# EAGLE design signal-tower (EAGLE 7.3.0)
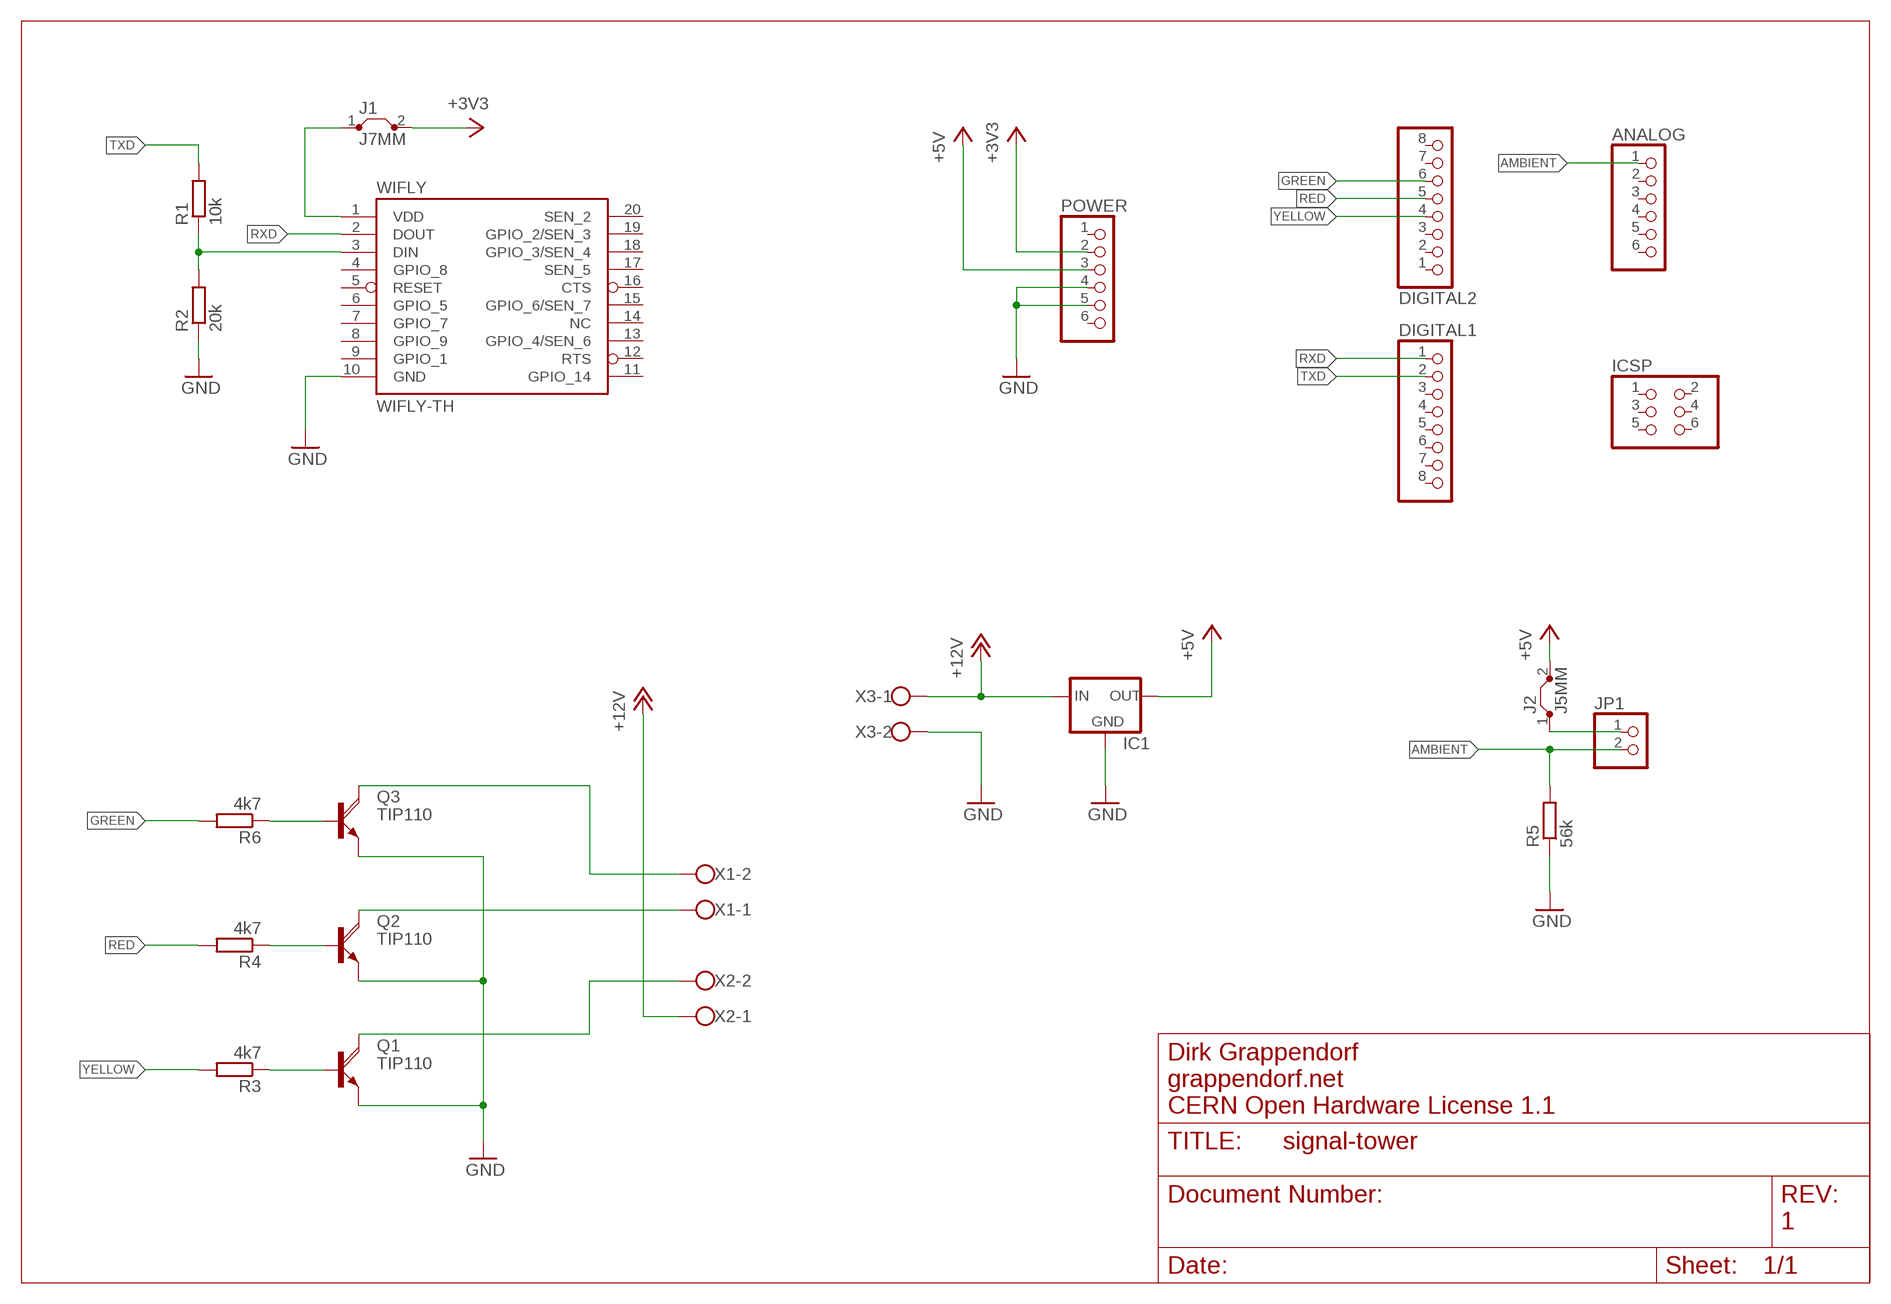
[diagram p0: schematic, sheet 1]

## Parts
ANALOG  PINHD-1X6  [1X06]
DIGITAL1  PINHD-1X8TH  [1X08-TH]
DIGITAL2  PINHD-1X8_2.54  [1X08]
IC1  78XXS  [78XXS]
ICSP  PINHD-2X3  [2X03]
J1  J7MM  [07]
J2  J5MM  [05]
JP1  PINHD-1X2  [1X02]
POWER  PINHD-1X6_2.54  [1X06]
Q1  TIP110  [TO220BV]
Q2  TIP110  [TO220BV]
Q3  TIP110  [TO220BV]
R1  10k  R-EU_0204/7  [0204/7]
R2  20k  R-EU_0204/7  [0204/7]
R3  4k7  R-EU_0204/7  [0204/7]
R4  4k7  R-EU_0204/7  [0204/7]
R5  56k  R-EU_0204/7  [0204/7]
R6  4k7  R-EU_0204/7  [0204/7]
WIFLY  WIFLY-TH  [WIFLY-TH]
X1  W237-102  [W237-102]
X2  W237-102  [W237-102]
X3  W237-102  [W237-102]

## Nets
+3V3: J1.2 POWER.2
+5V: IC1.OUT J2.2 POWER.3
+12V: IC1.IN X2.1 X3.1
AMBIENT: ANALOG.1 JP1.2 R5.2
GND: IC1.GND POWER.4 POWER.5 Q1.S(E) Q2.S(E) Q3.S(E) R2.1 R5.1 WIFLY.10(GND) X3.2
GREEN: DIGITAL2.6 R6.2
N$1: R1.1 R2.2 WIFLY.3(DIN)
N$2: Q3.D(C) X1.2
N$3: J1.1 WIFLY.1(VDD)
N$4: Q1.G(B) R3.1
N$5: Q2.G(B) R4.1
N$6: Q3.G(B) R6.1
N$7: Q2.D(C) X1.1
N$8: Q1.D(C) X2.2
N$10: J2.1 JP1.1
RED: DIGITAL2.5 R4.2
RXD: DIGITAL1.1 WIFLY.2(DOUT)
TXD: DIGITAL1.2 R1.2
YELLOW: DIGITAL2.4 R3.2
Unconnected: ANALOG.2 ANALOG.3 ANALOG.4 ANALOG.5 ANALOG.6 DIGITAL1.3 DIGITAL1.4 DIGITAL1.5 DIGITAL1.6 DIGITAL1.7 DIGITAL1.8 DIGITAL2.1 DIGITAL2.2 DIGITAL2.3 DIGITAL2.7 DIGITAL2.8 ICSP.1 ICSP.2 ICSP.3 ICSP.4 ICSP.5 ICSP.6 POWER.1 POWER.6 WIFLY.4(GPIO_8) WIFLY.5(RESET) WIFLY.6(GPIO_5) WIFLY.7(GPIO_7) WIFLY.8(GPIO_9) WIFLY.9(GPIO_1) WIFLY.11(GPIO_14) WIFLY.12(RTS) WIFLY.13(GPIO_4/SEN_6) WIFLY.14(NC) WIFLY.15(GPIO_6/SEN_7) WIFLY.16(CTS) WIFLY.17(SEN_5) WIFLY.18(GPIO_3/SEN_4) WIFLY.19(GPIO_2/SEN_3) WIFLY.20(SEN_2)

## Notes on the sheet
- Dirk Grappendorf
- grappendorf.net
- CERN Open Hardware License 1.1
- 1

## Library data of the parts
ANALOG = pinhead:PINHD-1X6: PIN HEADER
DIGITAL1 = SmartPrj:PINHD-1X8: PIN HEADER
DIGITAL2 = pinhead-1:PINHD-1X8: PIN HEADER
IC1 = v-reg:78XXS: VOLTAGE REGULATOR
ICSP = SmartPrj:PINHD-2X3: PIN HEADER
J1 J2 = jumper:J: Bridge
JP1 = pinhead:PINHD-1X2: PIN HEADER
POWER = pinhead-1:PINHD-1X6: PIN HEADER
Q1-Q3 = grapelabs:TIP110: NPN DARLINGTON TRANSISTOR
R1-R6 = rcl:R-EU_: RESISTOR, European symbol
WIFLY = grapelabs:WIFLY
X1-X3 = con-wago-500:W237-102: WAGO SCREW CLAMP; MPN: 237-102; OC_FARNELL: unknown; OC_NEWARK: 70K9898

## Board
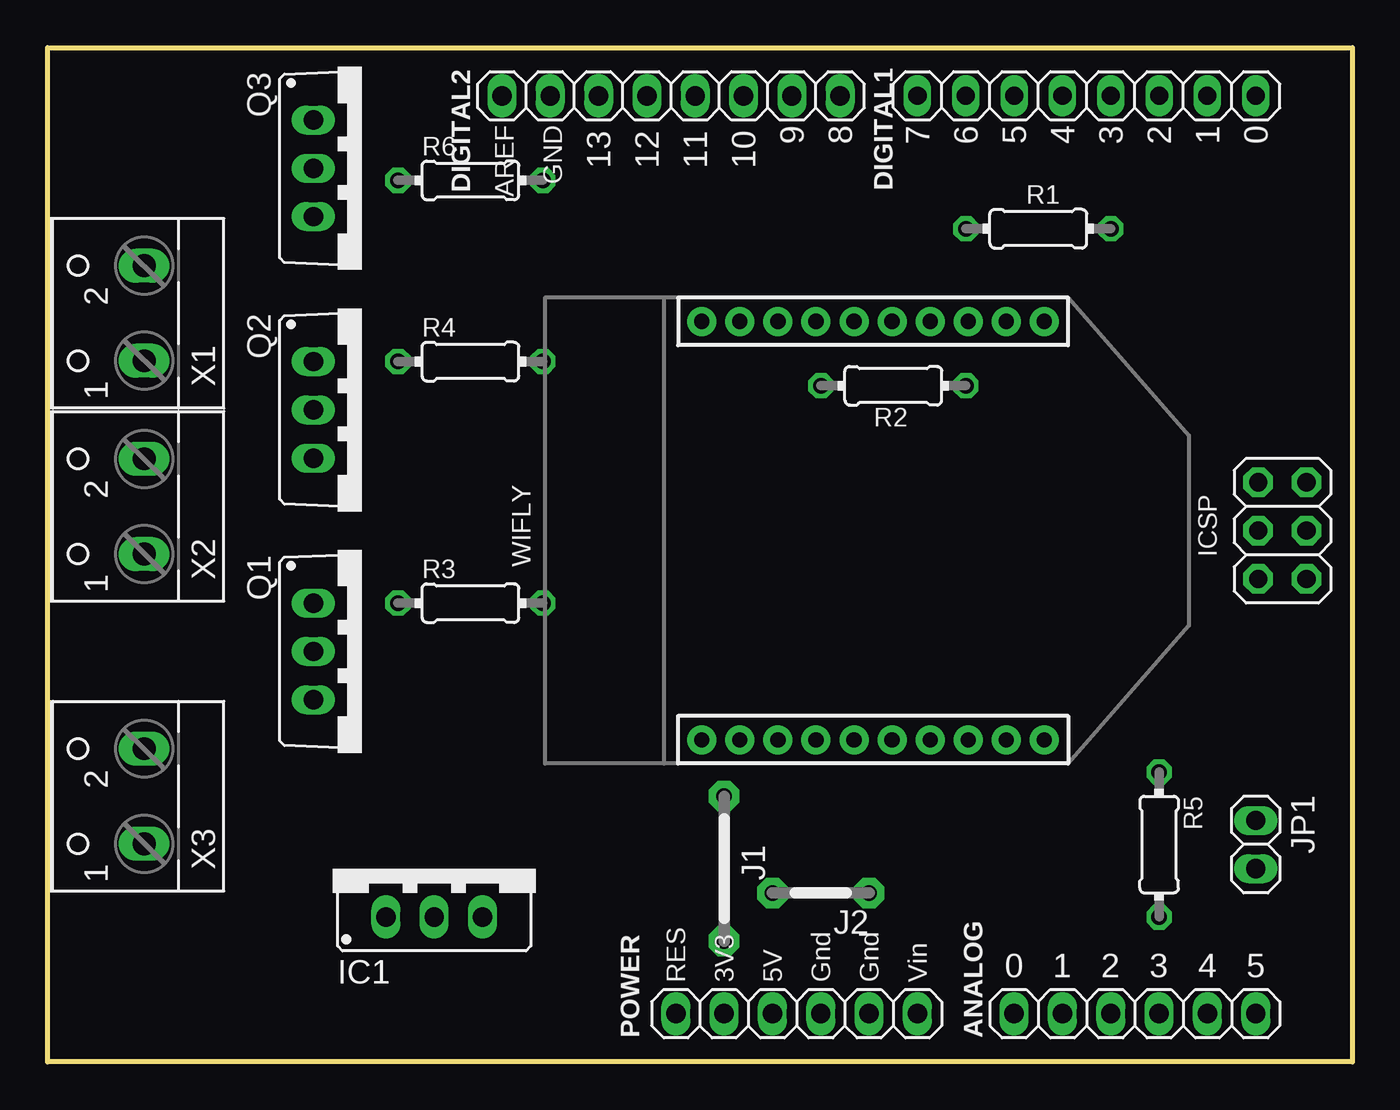
[diagram p1: board, top side]
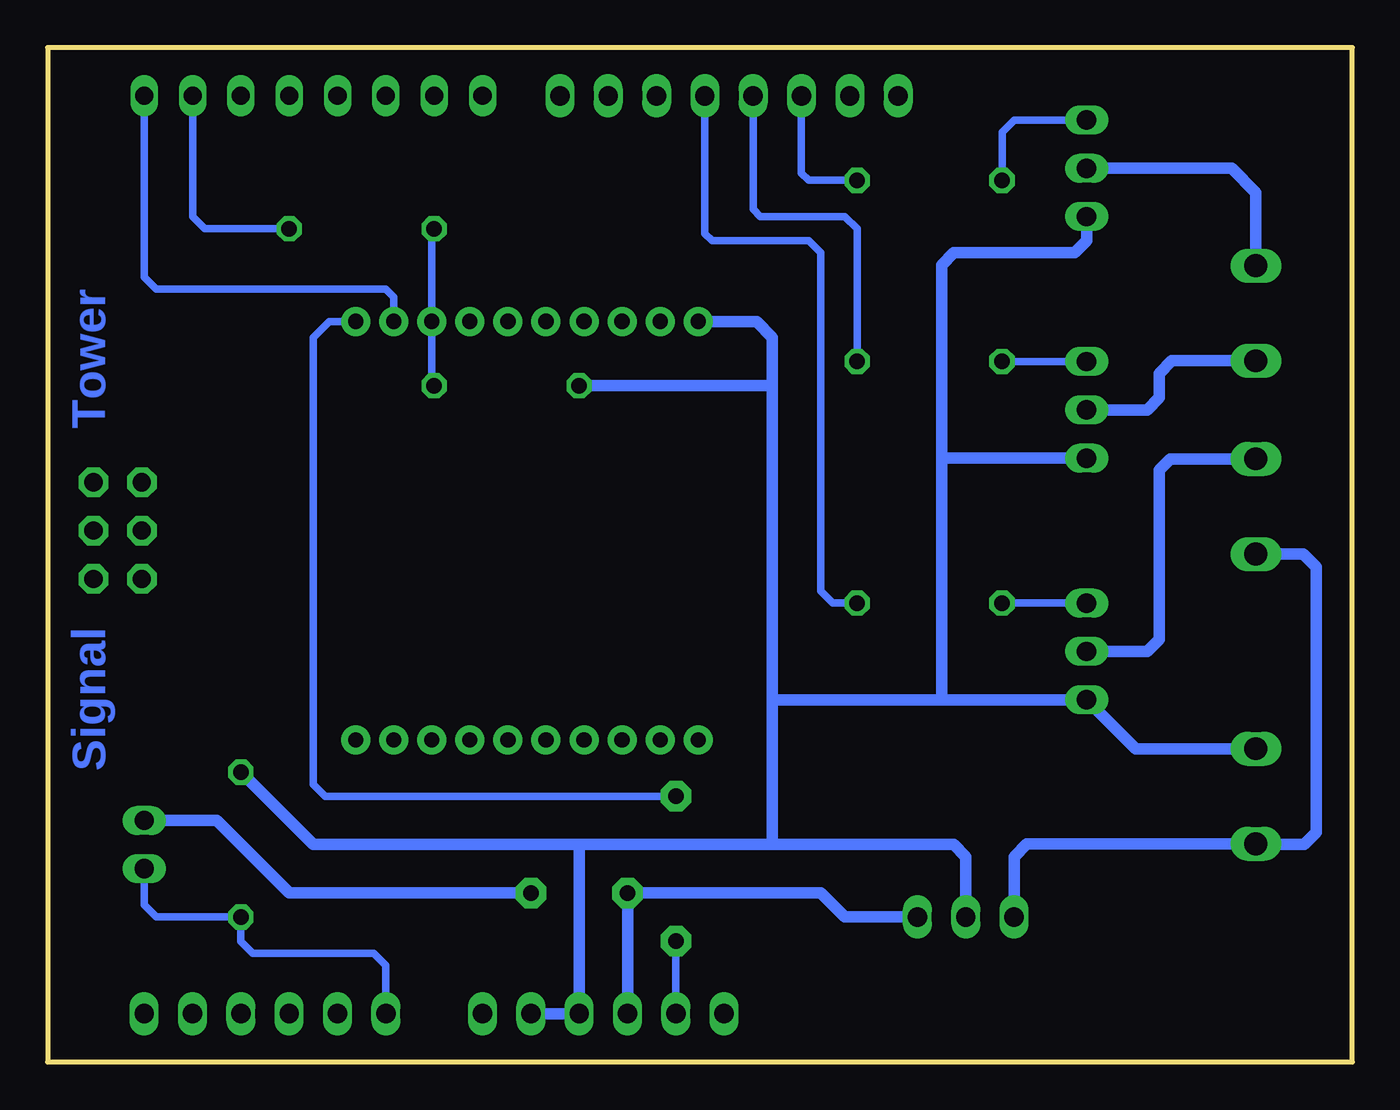
[diagram p2: board, bottom side, seen from below]

Size 68.58 x 53.34 mm. Coordinates in mm from the lower left corner, seen from the top.
Outline: 68.58,53.34 68.58,0 0,0 0,53.34 68.58,53.34
Copper layers (1*16): Top 0.035mm / dielectric 1.5mm / Bottom 0.035mm
Design rules "default": minimum track width 10mil, minimum drill 24mil, track to track 8mil, track to pad 8mil, pad to pad 8mil, via to via 8mil, smd to smd 8mil, copper to edge 40mil, drill to drill 8mil, minimum pad ring 10mil, minimum via ring 8mil, stop-mask expansion 2mil, vias tented up to drill 0mil, thermal gap 10mil

### Footprints (pad centres in the part's own frame; a part is rotated, then mirrored left to right if it is on the bottom)
1X06 = drill 1.016 long: 1 -6.35,0; 2 -3.81,0; 3 -1.27,0; 4 1.27,0; 5 3.81,0; 6 6.35,0
1X08-TH = drill 0.95 pad 1.422 long: 1 -8.89,0; 2 -6.35,0; 3 -3.81,0; 4 -1.27,0; 5 1.27,0; 6 3.81,0; 7 6.35,0; 8 8.89,0
1X08 = drill 1.016 long: 1 -8.89,0; 2 -6.35,0; 3 -3.81,0; 4 -1.27,0; 5 1.27,0; 6 3.81,0; 7 6.35,0; 8 8.89,0
78XXS = drill 1.016 long: GND 0,-2.54; IN -2.54,-2.54; OUT 2.54,-2.54
2X03 = drill 0.95 pad 1.55 octagon: 1 -2.54,-1.27; 2 -2.54,1.27; 3 0,-1.27; 4 0,1.27; 5 2.54,-1.27; 6 2.54,1.27
07 = drill 0.813 pad 1.6 octagon: 1 -3.81,0; 2 3.81,0
05 = drill 0.813 pad 1.6 octagon: 1 -2.54,0; 2 2.54,0
1X02 = drill 1.016 long: 1 -1.27,0; 2 1.27,0
TO220BV = drill 1.016 long: D 0,-2.54; G -2.54,-2.54; S 2.54,-2.54
0204/7 = drill 0.813 octagon: 1 -3.81,0; 2 3.81,0
WIFLY-TH = drill 0.8 pad 1.524: 1 -11,20; 2 -11,18; 3 -11,16; 4 -11,14; 5 -11,12; 6 -11,10; 7 -11,8; 8 -11,6; 9 -11,4; 10 -11,2; 11 11,2; 12 11,4; 13 11,6; 14 11,8; 15 11,10; 16 11,12; 17 11,14; 18 11,16; 19 11,18; 20 11,20
W237-102 = drill 1.194 long: 1 -2.5,-1.27; 2 2.5,-1.27

### Placement (x,y rotation side)
ANALOG  57.15,2.54 0 top
DIGITAL1  54.61,50.8 180 top
DIGITAL2  32.77,50.8 180 top
IC1  20.32,10.16 0 top
ICSP  64.9,27.94 270 top
J1  35.56,10.16 270 top
J2  40.64,8.89 180 top
JP1  63.5,11.43 270 top
POWER  39.37,2.54 0 top
Q1  16.51,21.59 270 top
Q2  16.51,34.29 270 top
Q3  16.51,46.99 270 top
R1  52.07,43.81 0 top
R2  44.45,35.56 0 top
R3  22.23,24.13 0 top
R4  22.23,36.83 0 top
R5  58.42,11.43 270 top
R6  22.23,46.35 0 top
WIFLY  32.38,27.94 270 top
X1  3.81,39.37 90 top
X2  3.81,29.21 90 top
X3  3.81,13.97 90 top

### Tracks (layer width: path | path; a pad name or v marks a point on that pad's centre or on a via)
+3V3
  Bottom 0.406: POWER.2 J1.2
+5V
  Bottom 0.61: POWER.3 J2.2 27.94,8.89 26.67,7.62 IC1.OUT
+12V
  Bottom 0.61: X2.1 2.58,26.71 1.91,26.04 1.91,12.06 2.54,11.43 5.04,11.43 X3.1 17.11,11.47 17.78,10.79 IC1.IN
AMBIENT
  Bottom 0.406: ANALOG.1 50.8,5.08 51.44,5.71 57.78,5.71 58.42,6.35 R5.2 62.87,7.62 63.5,8.26 JP1.2
GND
  Bottom 0.61: R2.1 30.48,35.56 | 30.48,35.56 30.48,31.75 30.48,19.05 | 21.59,19.05 19.05,19.05 Q1.S 11.39,16.47 X3.2 | 21.59,19.05 30.48,19.05 | 21.59,31.75 21.59,19.05 | Q2.S 21.59,31.75 | IC1.GND 20.32,10.79 20.95,11.43 30.48,11.43 | 30.48,11.43 30.48,19.05 | 30.48,11.43 40.64,11.43 | 40.64,11.43 POWER.4 POWER.5 | 40.64,11.43 54.61,11.43 R5.1 | Q3.S 13.97,43.18 14.61,42.55 20.95,42.55 21.59,41.91 21.59,31.75 | WIFLY.10 31.32,38.94 30.48,38.1 30.48,35.56
GREEN
  Bottom 0.406: R6.2 28.57,46.35 28.96,46.74 DIGITAL2.6
N$1
  Bottom 0.406: R2.2 48.38,35.69 WIFLY.3 48.38,43.69 R1.1
N$2
  Bottom 0.61: X1.2 5.08,45.72 6.35,46.99 Q3.D
N$3
  Bottom 0.406: WIFLY.1 53.77,38.94 54.61,38.1 54.61,14.61 53.98,13.97 J1.1
N$4
  Bottom 0.406: R3.1 Q1.G
N$5
  Bottom 0.406: R4.1 Q2.G
N$6
  Bottom 0.406: Q3.G 17.78,49.53 18.41,48.9 R6.1
N$7
  Bottom 0.61: X1.1 9.48,36.87 10.16,36.2 10.16,34.92 10.79,34.29 Q2.D
N$8
  Bottom 0.61: X2.2 9.56,31.71 10.16,31.11 10.16,22.23 10.79,21.59 Q1.D
N$10
  Bottom 0.61: J2.1 55.88,8.89 59.69,12.7 JP1.1
RED
  Bottom 0.406: R4.2 26.04,43.81 26.67,44.45 31.11,44.45 31.5,44.83 DIGITAL2.5
RXD
  Bottom 0.406: WIFLY.2 50.38,40.23 50.8,40.64 62.87,40.64 63.5,41.27 DIGITAL1.1
TXD
  Bottom 0.406: DIGITAL1.2 60.96,44.45 60.33,43.81 R1.2
YELLOW
  Bottom 0.406: R3.2 27.3,24.13 27.94,24.77 27.94,42.55 28.57,43.18 33.66,43.18 34.04,43.56 DIGITAL2.4

### Text on the board
Bottom: Tower | Signal
tPlace: 9 | 8 | 7 | 6 | 5 | 4 | 3 | 2 | 1 | 0 | 13 | 12 | 11 | 10
tNames: AREF | GND | RES | 3V3 | 5V | Gnd | Gnd | Vin | 0 | 1 | 2 | 3 | 4 | 5
bStop: 1 | 2 | 3 | 4 | 5 | 6
Reference: USB | ETH